# Altium schematic sheet MCU.SchDoc
size A4; SheetNumber: 1; SheetTotal: 1
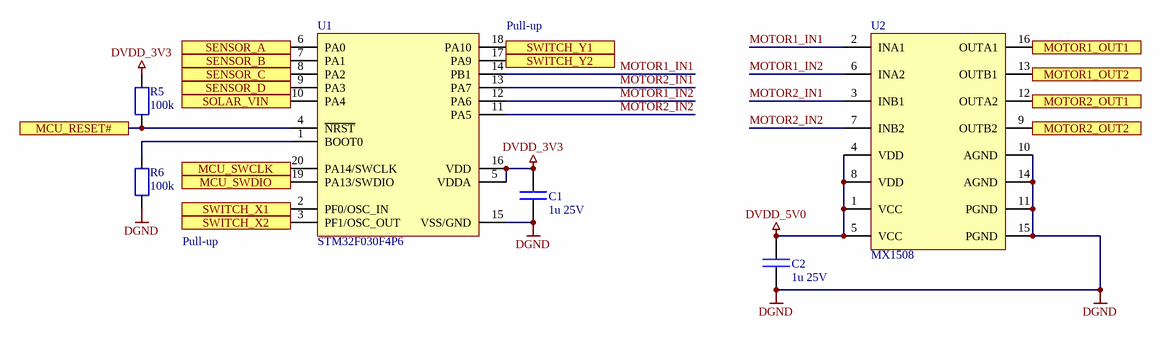
[diagram p0: MCU.SchDoc]

## Parts
C1  1u 25V  [C_0603/1608]
C2  1u 25V  [C_0603/1608]
R5  100k  [R_0603/1608]
R6  100k  [R_0603/1608]
U1  STM32F030F4P6  [SO20_0.65]
U2  MX1508  [SO16_1.27]

## Ports
MCU_RESET#, MCU_SWCLK, MCU_SWDIO, MOTOR1_OUT1, MOTOR1_OUT2, MOTOR2_OUT1, MOTOR2_OUT2, SENSOR_A, SENSOR_B, SENSOR_C, SENSOR_D, SOLAR_VIN, SWITCH_X1, SWITCH_X2, SWITCH_Y1, SWITCH_Y2

## Nets
DGND: C1.2 C2.2 R6.1 U1.15(VSS/GND) U2.10(AGND) U2.11(PGND) U2.14(AGND) U2.15(PGND)
DVDD_3V3: C1.1 R5.1 U1.5(VDDA) U1.16(VDD)
DVDD_5V0: C2.1 U2.1(VCC) U2.4(VDD) U2.5(VCC) U2.8(VDD)
MCU_RESET#: R5.2 U1.4(~{NRST}) ; port MCU_RESET#
MCU_SWCLK: U1.20(PA14/SWCLK) ; port MCU_SWCLK
MCU_SWDIO: U1.19(PA13/SWDIO) ; port MCU_SWDIO
MOTOR1_IN1: U1.14(PB1) U2.2(INA1)
MOTOR1_IN2: U1.12(PA6) U2.6(INA2)
MOTOR1_OUT1: U2.16(OUTA1) ; port MOTOR1_OUT1
MOTOR1_OUT2: U2.13(OUTB1) ; port MOTOR1_OUT2
MOTOR2_IN1: U1.13(PA7) U2.3(INB1)
MOTOR2_IN2: U1.11(PA5) U2.7(INB2)
MOTOR2_OUT1: U2.12(OUTA2) ; port MOTOR2_OUT1
MOTOR2_OUT2: U2.9(OUTB2) ; port MOTOR2_OUT2
SENSOR_A: U1.6(PA0) ; port SENSOR_A
SENSOR_B: U1.7(PA1) ; port SENSOR_B
SENSOR_C: U1.8(PA2) ; port SENSOR_C
SENSOR_D: U1.9(PA3) ; port SENSOR_D
SOLAR_VIN: U1.10(PA4) ; port SOLAR_VIN
SWITCH_X1: U1.2(PF0/OSC_IN) ; port SWITCH_X1
SWITCH_X2: U1.3(PF1/OSC_OUT) ; port SWITCH_X2
SWITCH_Y1: U1.18(PA10) ; port SWITCH_Y1
SWITCH_Y2: U1.17(PA9) ; port SWITCH_Y2
NetR6_2: R6.2 U1.1(BOOT0)

Not connected (* = marked no-connect by the designer): U1 0(EP)

## Notes on the sheet
- (near U1) Pull-up
- Pull-up

## Library data of the parts
C1 C2 = Capacitor: Non-polarized capacitor
R5 R6 = Resistor
U1 = STM32F030F: 32-bit Cortex-M0
U2 = MX1508: Dual DC motor driver